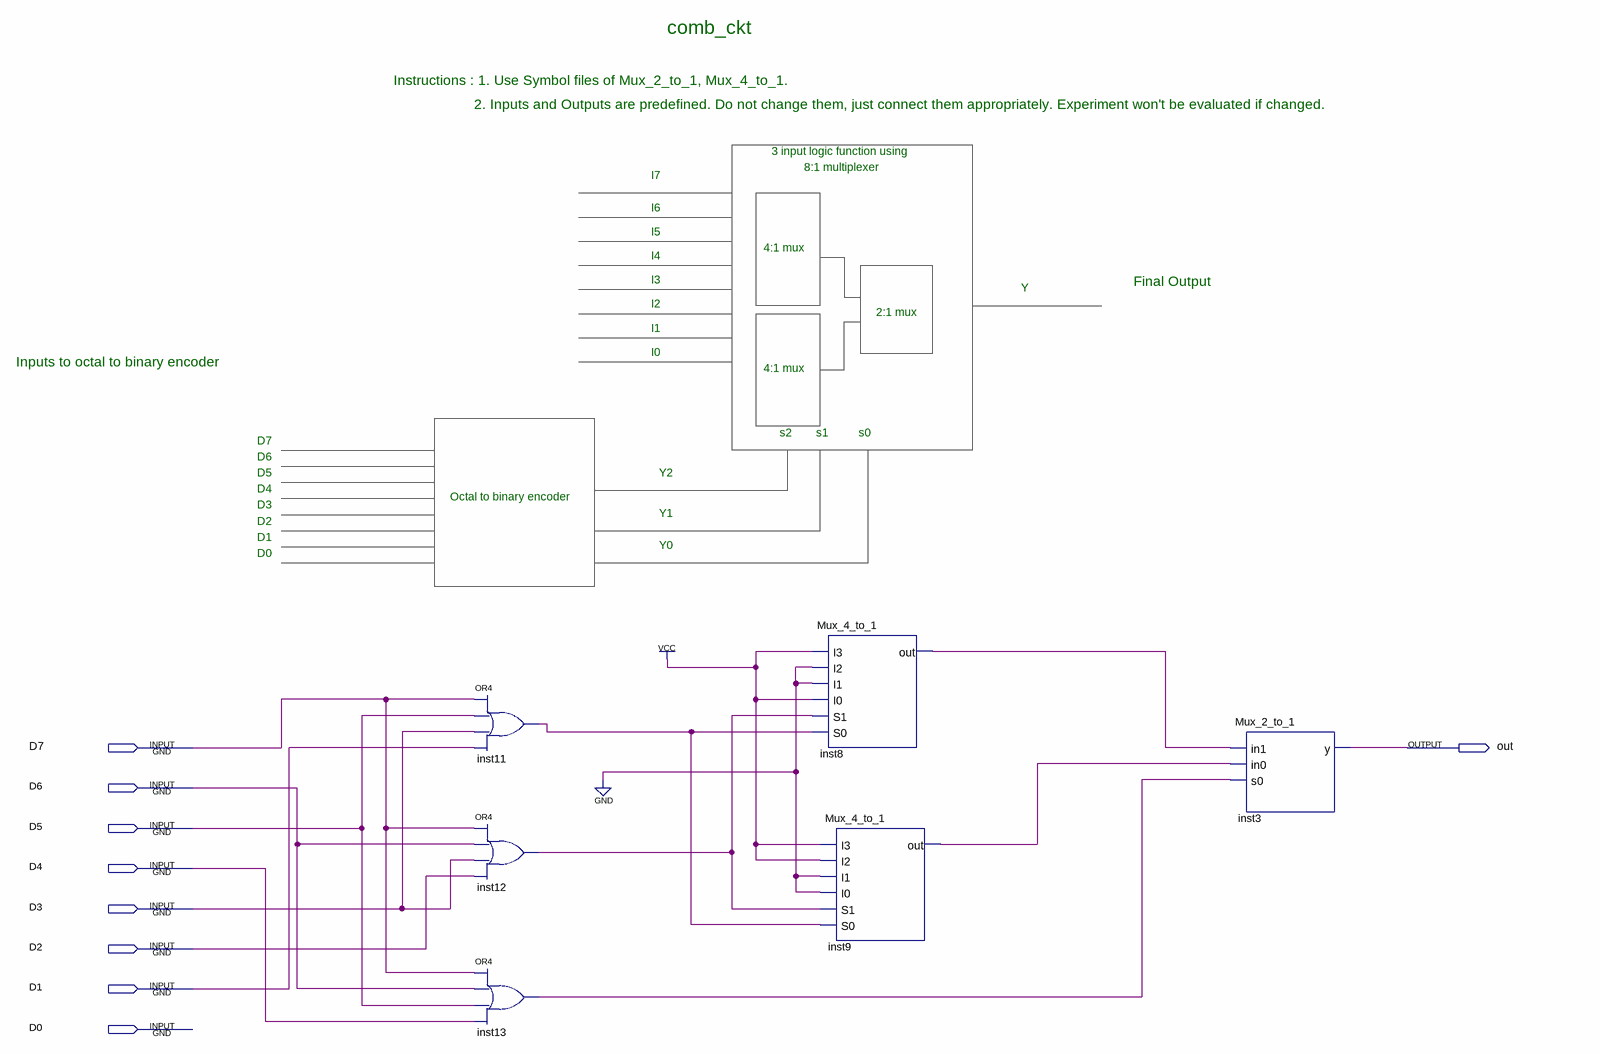
[diagram p0: schematic sheet]
// Quartus schematic comb_ckt.bdf as structural Verilog: 6 symbols, 9 pins
module comb_ckt (
  input  D7,
  input  D6,
  input  D5,
  input  D4,
  input  D3,
  input  D2,
  input  D1,
  input  D0,
  output out
);

  wire inst8_out, inst9_out, inst11_out, inst12_out, inst13_out;

  or inst11 (inst11_out, D7, D5, D3, D1);
  or inst12 (inst12_out, D7, D6, D3, D2);
  or inst13 (inst13_out, D7, D6, D5, D4);
  Mux_4_to_1 inst8 (.I3(1'b1), .I2(1'b0), .I1(1'b0), .I0(1'b1), .S1(inst12_out), .S0(inst11_out), .out(inst8_out));
  Mux_4_to_1 inst9 (.I3(1'b1), .I2(1'b1), .I1(1'b0), .I0(1'b0), .S1(inst12_out), .S0(inst11_out), .out(inst9_out));
  Mux_2_to_1 inst3 (.in1(inst8_out), .in0(inst9_out), .s0(inst13_out), .y(out));

  // Notes on the sheet:
  //   comb_ckt
  //   Instructions : 1. Use Symbol files of Mux_2_to_1, Mux_4_to_1. 
  //   2. Inputs and Outputs are predefined. Do not change them, just connect them appropriately. Experiment won't be evaluated if changed.
  //   3 input logic function using 
  //   8:1 multiplexer
  //   I7
  //   I6
  //   I5
  //   4:1 mux
  //   I4
  //   I3
  //   Final Output
  //   Y
  //   I2
  //   2:1 mux
  //   I1
  //   I0
  //   Inputs to octal to binary encoder
  //   4:1 mux
  //   s2        s1          s0      
  //   D7
  //   D6
  //   D5
  //   Y2
  //   D4
  //   Octal to binary encoder
  //   D3
  //   Y1
  //   D2
  //   D1
  //   Y0
  //   D0
endmodule
